# EAGLE board node6.7-frontend (EAGLE 5.10)
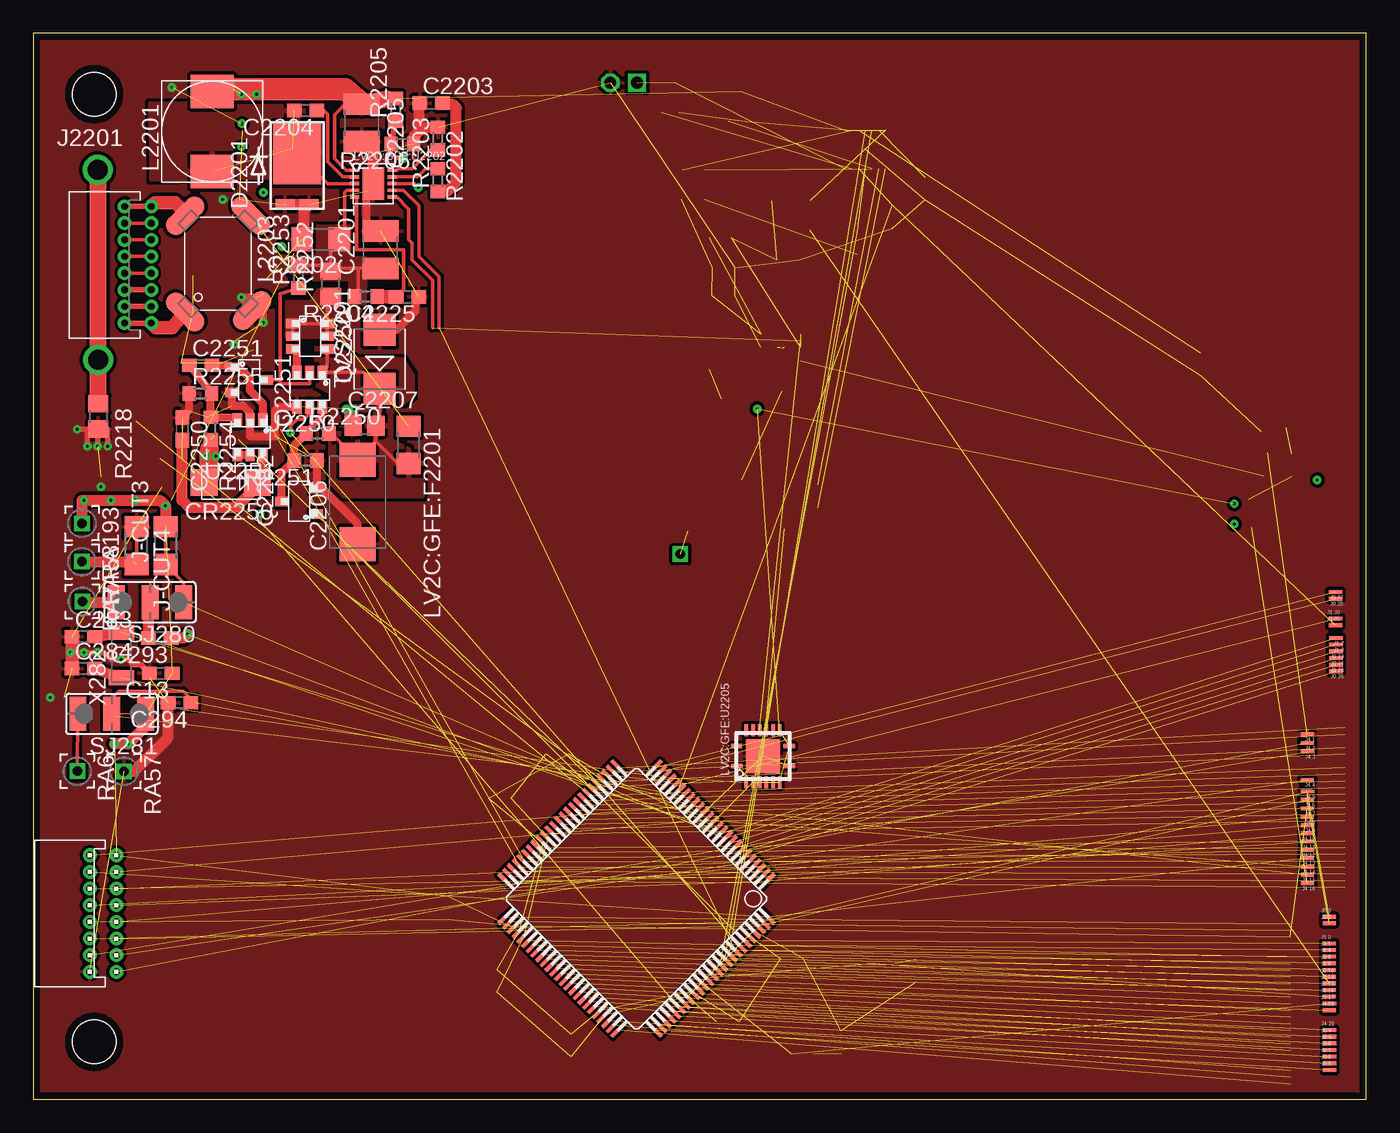
[diagram p2: board, top side]
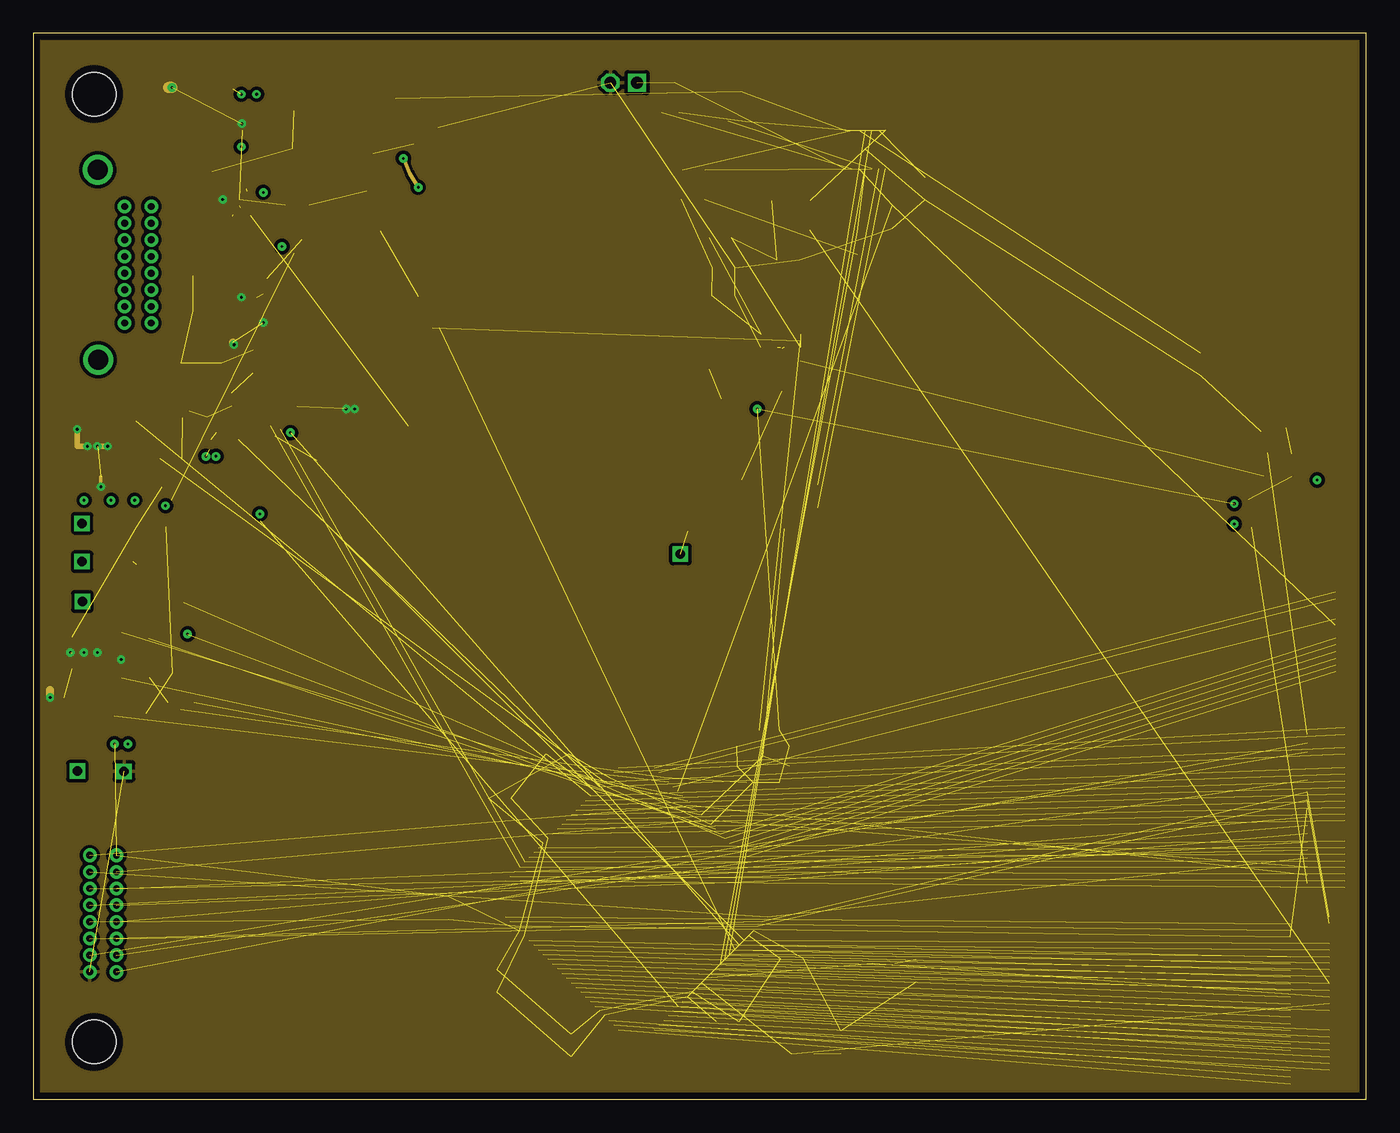
[diagram p3: board, inner layer Route2]
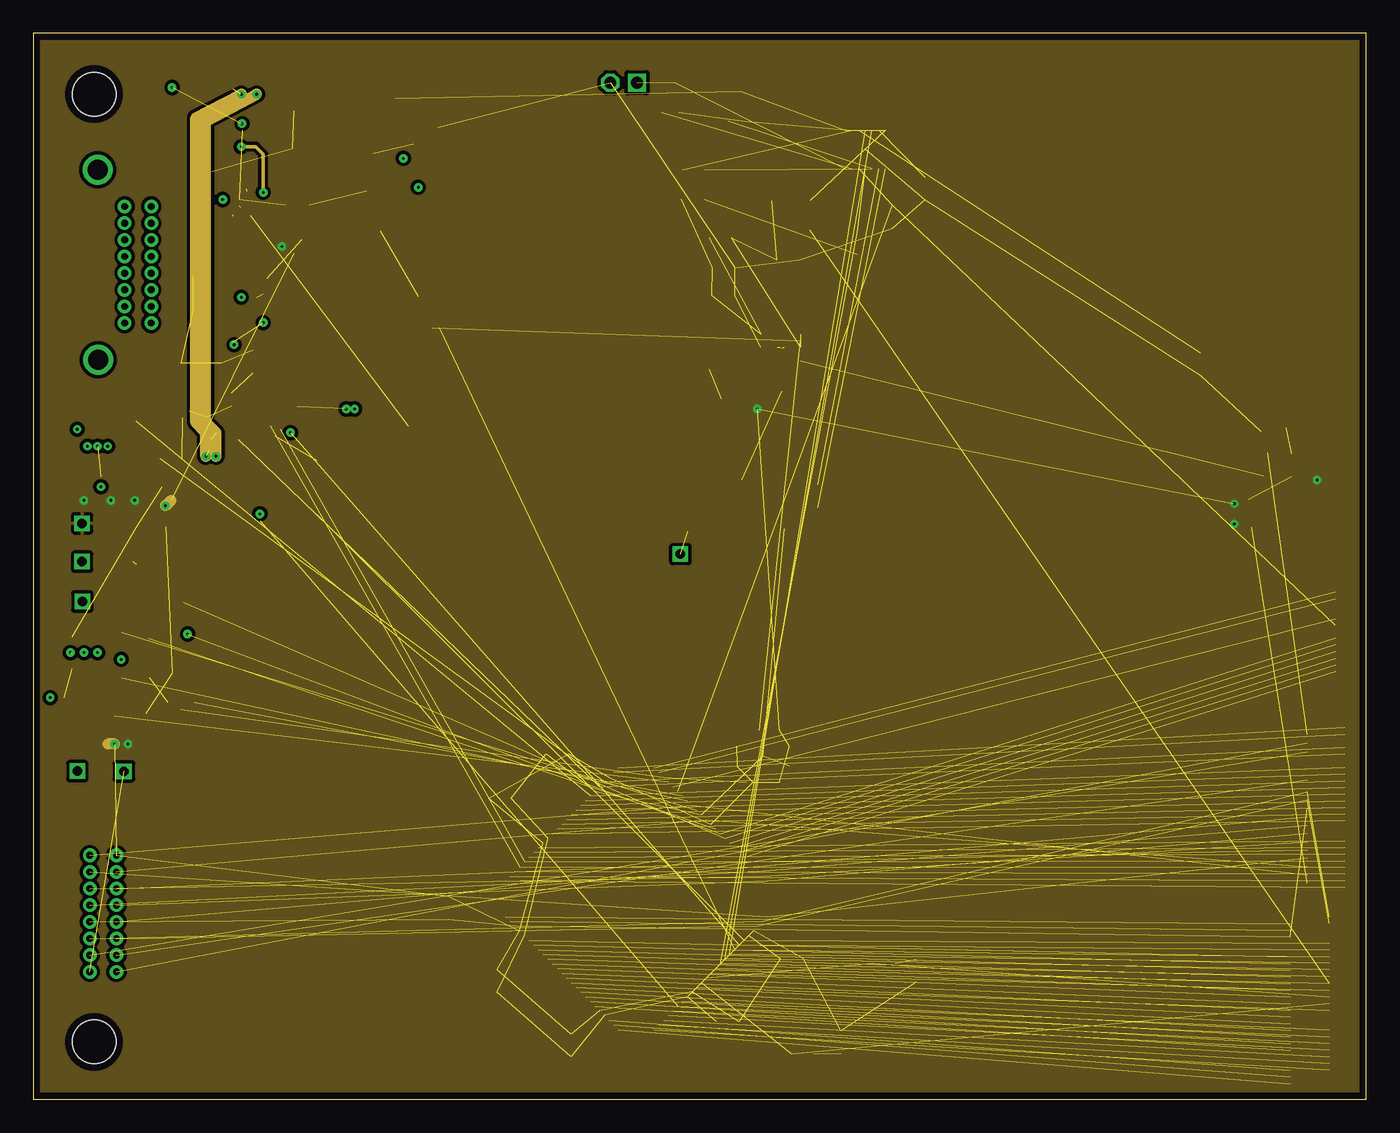
[diagram p4: board, inner layer Route15]
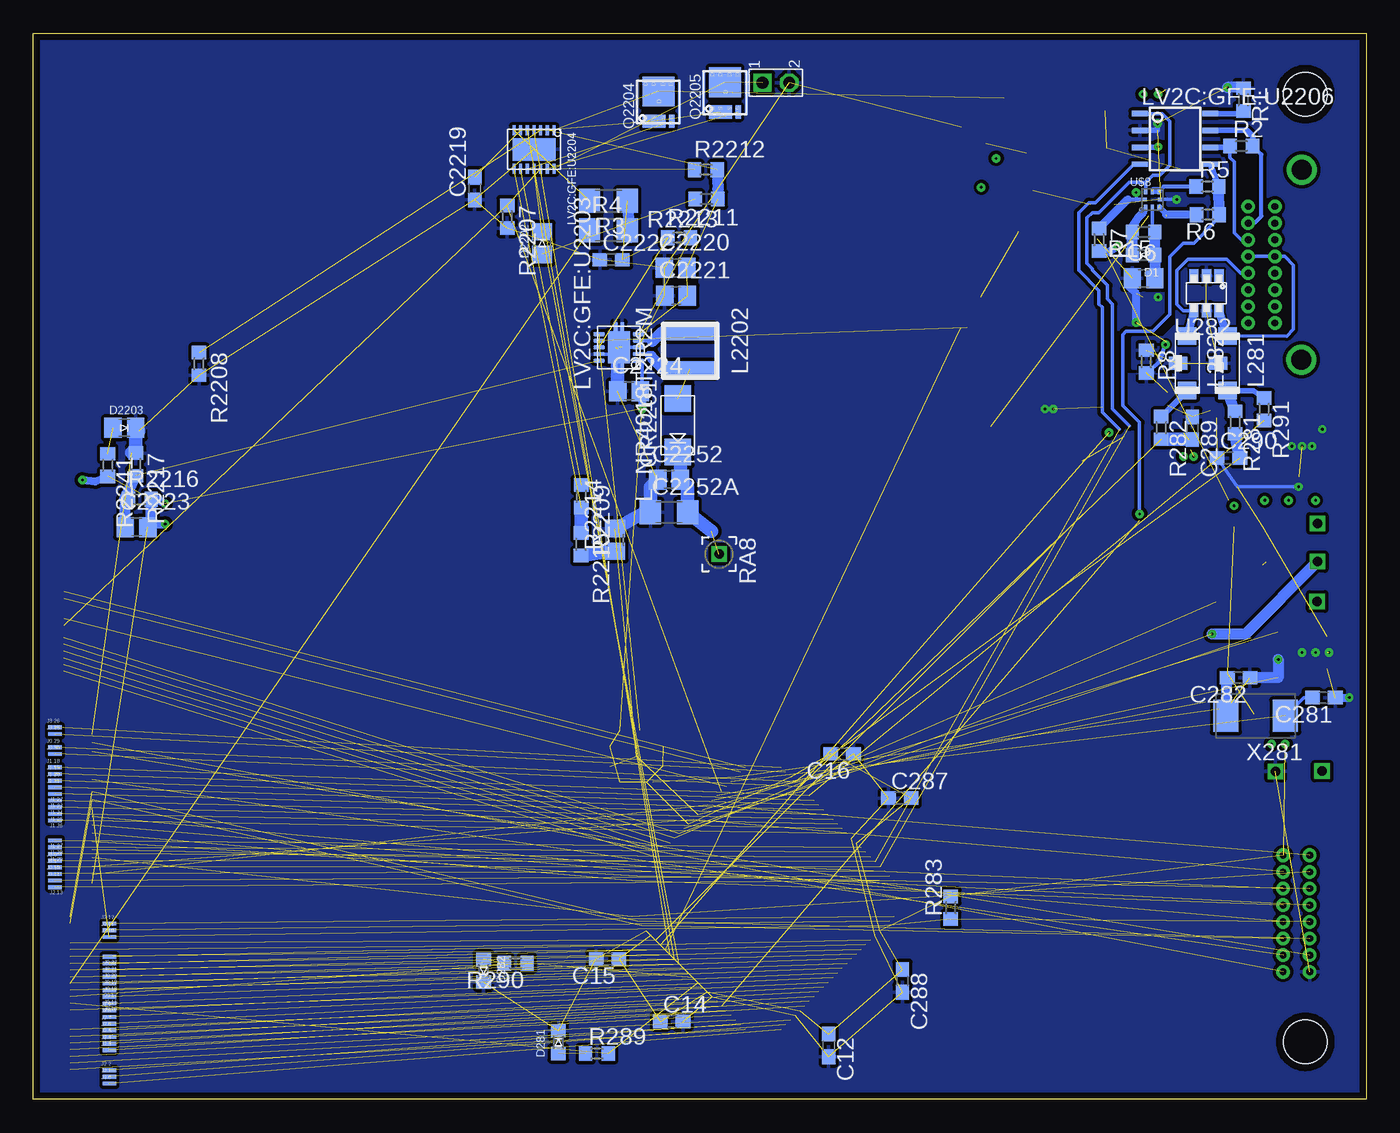
[diagram p5: board, bottom side, seen from below]

Size 100.08 x 80.01 mm. Coordinates in mm from the lower left corner, seen from the top.
Outline: 0,0 100.08,0 100.08,80.01 0,80 0,0
Copper layers (1+2*15+16): Top 0.0432mm / dielectric 0.3048mm / Route2 0.0356mm / dielectric 0.7112mm / Route15 0.0356mm / dielectric 0.3023mm / Bottom 0.0432mm
Design rules "sunstone_4lr_rules_v1.3_modifid *": minimum track width 6mil, minimum drill 8mil, track to track 6mil, track to pad 6mil, pad to pad 6mil, via to via 6mil, smd to smd 6mil, copper to edge 20mil, drill to drill 16mil, minimum pad ring 0.2118mm, minimum via ring 0.2118mm, stop-mask expansion 3mil, vias tented up to drill 0mil, thermal gap 10mil

## Footprints (pad centres in the part's own frame; a part is rotated, then mirrored left to right if it is on the bottom)
2MM-1X2-HEADER = drill 0.889 pad 1.372 square: 1 0,-1 | drill 0.889 pad 1.372 octagon: 2 0,1
C0805 = smd 1.3 x 1.5: 1 -0.85,0; 2 0.85,0
C0603 = smd 1.1 x 1: 1 -0.85,0; 2 0.85,0
C1210 = smd 1.6 x 2.7: 1 -1.4,0; 2 1.4,0
C1206 = smd 1.6 x 1.8: 1 -1.4,0; 2 1.4,0
D/7343-31R = smd 2.55 x 2.7: + 3.175,0; - -3.175,0
NMINIP2-J1 = smd 2 x 2: A 2,0; C -2,0
0603-DIODE = smd 1 x 1.1: A -0.85,0; K 0.85,0
D_POWERDI5 = smd 0.8 x 1.4: ANODE1 -3.47,-0.8; ANODE2 -3.47,1 | smd 4.7 x 3.6: CATHODE 0.4,0.1
0805-DIODE = smd 1.3 x 1.5: 1(ANODE) -0.85,0; 2(CATHODE) 0.85,0
ITTY-BITTY-PAD = smd 0.28 x 1: P$1 0,0
ROCKETBUS-PKG = drill 0.508 pad 1.016 round: AUX_1@1 0,-1.875; AUX_1@2 2,-1.875; AUX_2@1 0,-3.125; AUX_2@2 2,-3.125; B+@1 0,4.375; B+@2 2,4.375; B-@1 0,-4.375; B-@2 2,-4.375; CAN_H@1 0,3.125; CAN_H@2 2,3.125; CAN_L@1 0,1.875; CAN_L@2 2,1.875; USB_H@1 0,0.625; USB_H@2 2,0.625; USB_L@1 0,-0.625; USB_L@2 2,-0.625 | drill 1.511 round: CHASSIS@1 -2.032,7.136; CHASSIS@2 -1.982,-7.136
JST-16PS-JED = drill 0.508 pad 1.016 round: 1 4.375,-2; 2 4.375,0; 3 3.125,-2; 4 3.125,0; 5 1.875,-2; 6 1.875,0; 7 0.625,-2; 8 0.625,0; 9 -0.625,-2; 10 -0.625,0; 11 -1.875,-2; 12 -1.875,0; 13 -3.125,-2; 14 -3.125,0; 15 -4.375,-2; 16 -4.375,0
ZJ1206B = smd 1.6 x 1.803: 1 -1.422,0; 2 1.422,0
STAND-OFF = hole 3.302: 0,0
EXC-CET = smd 1.3 x 1.4: 1 -2.05,0; 2 2.05,0 | smd 1 x 1.4: C 0,-0.7
L-DR74 = smd 2.5 x 3.25: 1 -3,0; 2 3,0
L_NR4018 = smd 1.2 x 3.7: 1 -1.4,0; 2 1.4,0
CMS1 = smd 3.5 x 1.5 rotated 45: 1 3.608,-2.462; 3 -3.608,2.462 | smd 3.5 x 1.5 rotated 315: 2 3.508,2.562; 4 -3.608,-2.462
1206 = smd 1.6 x 1.8: 1 -1.4,0; 2 1.4,0
LQFP100 = smd 0.28 x 1.5: #RESET 2,-7.9; #RSTOUT 0.5,-7.9; #TRST -4.5,-7.9; P0[15]/TXD1/SCK0/SCK 0.5,7.9; P0[16]/RXD1/SSEL0/SSEL 0,7.9; P0[17]/CTS1/MISO0/MISO 1,7.9; P0[18]/DCD1/MOSI0/MOSI 1.5,7.9; P0[19]/DSR1/MCICLK/SDA1 2,7.9; P0[20]/DTR1/MCICMD/SCL1 2.5,7.9; P0[21]/RI1/MCIPWR/RD1 3,7.9; P0[22]/RTS1/MCIDAT0/TD1 3.5,7.9; P0[23]/AD0[0]/I2SRX_CLK/CAP3[0] -2,-7.9; P0[24]/AD0[1]/I2SRX_WS/CAP3[1] -2.5,-7.9; P0[25]/AD0[2]/I2SRX_SDA/TXD3 -3,-7.9; P0[26]/AD0[3]/AOUT/RXD3 -3.5,-7.9; P0[27]/SDA0 6,-7.9; P0[28]/SCL0 5.5,-7.9; P1[30]/VBUS/AD0[4] 4,-7.9; P1[31]/SCK1/AD0[5] 3.5,-7.9; P2[0]/PWM1[1]/TXD1/TRACECLK -6,7.9; P2[1]/PWM1[2]/RXD1/PIPESTAT0 -5.5,7.9; P2[2]/PWM1[3]/CTS1/PIPESTAT1 -5,7.9; P2[3]/PWM1[4]/DCD1/PIPESTAT2 -3.5,7.9; P2[4]/PWM1[5]/DSR1/TRACESYNC -3,7.9; P2[5]/PWM1[6]/DTR1/TRACEPKT0 -2.5,7.9; P2[6]/PCAP1[0]/RI1/TRACEPKT1 -2,7.9; P2[7]/RD2/RTS1/TRACEPKT2 -1.5,7.9; P2[8]/TD2/TXD2/TRACEPKT3 -1,7.9; P2[9]/USB_CONNECT/RXD2/EXTIN0 -0.5,7.9; P2[10]/#EINT0 5,7.9; P2[11]/#EINT1/MCIDAT1/I2STX_CLK 5.5,7.9; P2[12]/#EINT2/MCIDAT2/I2STX_WS 6,7.9; RTCX1 1.5,-7.9; RTCX2 2.5,-7.9; TCK -4,-7.9; TDI -5.5,-7.9; TDO -6,-7.9; TMS -5,-7.9; VBAT 3,-7.9; VDD(3V3)@1 4.5,7.9; VDD(3V3)@2 -4,7.9; VDD(DCDC)(3V3) 0,-7.9; VDDA -1.5,-7.9; VREF -0.5,-7.9; VSS 1,-7.9; VSS@3 4,7.9; VSS@4 -4.5,7.9; VSSA -1,-7.9; XTAL1 4.5,-7.9; XTAL2 5,-7.9 | smd 1.5 x 0.28: P0[0]/RD1/TXD3/SDA1 7.9,4; P0[1]/TD1/RXD3/SCL1 7.9,4.5; P0[2]/TXD0 -7.9,-5; P0[3]/RXD0 -7.9,-5.5; P0[4]/I2SRX_CLK/RD2/CAP2[0] -7.9,3.5; P0[5]/I2SRX_WS/TD2/CAP2[1] -7.9,4; P0[6]/I2SRX_SDA/SSEL1/MAT2[0] -7.9,4.5; P0[7]/I2STX_CLK/SCK1/MAT2[1] -7.9,5; P0[8]/I2STX_WS/MISO1/MAT2[2] -7.9,5.5; P0[9]/I2STX_SDA/MOSI1/MAT2[3] -7.9,6; P0[10]/TXD2/SDA2/MAT3[0] 7.9,5; P0[11]/RXD2/SCL2/MAT3[1] 7.9,5.5; P0[29]/USB_D+ 7.9,-4.5; P0[30]/USB_D- 7.9,-4; P1[0]/ENET_TXD0 -7.9,-3.5; P1[1]/ENET_TXD1 -7.9,-3; P1[4]/ENET_TX_EN -7.9,-2.5; P1[8]/ENET_CRS -7.9,-2; P1[9]/ENET_RXD0 -7.9,-1.5; P1[10]/ENET_RXD1 -7.9,-1; P1[14]/ENET_RX_ER -7.9,-0.5; P1[15]/ENET_REF_CLK -7.9,0; P1[16]/ENET_MDC -7.9,0.5; P1[17]/ENET_MDIO -7.9,1; P1[18]/USB_UP_LED/PWM1[1]/CAP1[0] 7.9,-3; P1[19]/CAP1[1] 7.9,-2.5; P1[20]/PWM1[2]/SCK0 7.9,-2; P1[21]/PWM1[3]/SSEL0 7.9,-1.5; P1[22]MAT1[0] 7.9,-1; P1[23]/PWM1[4]/MISO0 7.9,-0.5; P1[24]/PWM1[5]/MOSI0 7.9,0; P1[25]/MAT1[1] 7.9,0.5; P1[26]/PWM1[6]/CAP0[0] 7.9,1; P1[27]/CAP0[1] 7.9,2.5; P1[28]/PCAP1[0]/MAT0[0] 7.9,3; P1[29]/PCAP1[1]/MAT0[1] 7.9,3.5; P2[13]/#EINT3/MCIDAT3/I2STX_SDA 7.9,6; P3[25]/MAT0[0]/PWM1[2] 7.9,-5.5; P3[26]/MAT0[1]/PWM1[3] 7.9,-6; P4[28]/MAT2[0]/TXD3 -7.9,3; P4[29]/MAT2[1]/RXD3 -7.9,1.5; RTCK -7.9,-6; VDD(3V3) 7.9,-5; VDD(3V3)@3 -7.9,-4; VDD(DCDC)(3V3)@1 7.9,2; VDD(DCDC)(3V3)@2 -7.9,2; VSS@1 7.9,-3.5; VSS@2 7.9,1.5; VSS@5 -7.9,-4.5; VSS@6 -7.9,2.5
DFN-10 = smd 0.25 x 0.675: BD -1,-1.413; BOOST -0.5,-1.413; FB 0,1.413; PG 0.5,1.413; RT -1,1.413; RUN/SS 1,-1.413; SW 0,-1.413; SYNC 1,1.413; VC -0.5,1.413; VIN 0.5,-1.413 | smd 2.38 x 1.65: GND 0,0
SON-10 = smd 0.28 x 0.85: EN 1,1.475; FB -1,1.475; GND -0.5,1.475; L1 0.5,-1.475; L2 -0.5,-1.475; PGND 0,-1.475; PS/SYNC 0.5,1.475; VIN 1,-1.475; VINA 0,1.475; VOUT -1,-1.475 | smd 2.4 x 1.65: PGND@1 0,0 | smd 3.8 x 0.28: PGND@2 0,0.25; PGND@3 0,-0.25
DFN-14 = smd 0.25 x 0.7: 1 -1.5,-1.45; 2 -1,-1.45; 3 -0.5,-1.45; 4 0,-1.45; 5 0.5,-1.45; 6 1,-1.45; 7 1.5,-1.45; 8 1.5,1.45; 9 1,1.45; 10 0.5,1.45; 11 0,1.45; 12 -0.5,1.45; 13 -1,1.45; 14 -1.5,1.45 | smd 3.3 x 1.7: PGND 0,0
QFN-16 = smd 0.85 x 0.28: 1 -1.97,-0.75; 8 1.97,-0.74; 9 1.97,0.75; 16 -1.98,0.75 | smd 0.28 x 0.85: 2 -1.25,-1.95; 3 -0.75,-1.95; 4 -0.25,-1.95; 5 0.25,-1.95; 6 0.75,-1.95; 7 1.25,-1.95; 10 1.25,1.95; 11 0.75,1.95; 12 0.25,1.95; 13 -0.25,1.95; 14 -0.75,1.95; 15 -1.25,1.95 | smd 2.55 x 2.55: PGND 0,0
DR-PDSO-G8 = smd 0.4 x 1.2: 1 -1.905,-2.65; 2 -0.635,-2.65; 3 0.635,-2.65; 4 1.905,-2.65; 5 1.905,2.65; 6 0.635,2.65; 7 -0.635,2.65; 8 -1.905,2.65
1212-8_POWERPAK = smd 0.99 x 1.725: 1-2-3 -1.45,0.33 | smd 0.99 x 0.405: 4 -1.45,-0.99 | smd 2.24 x 2.39: 5-6-7-8 0.797,0
SOT23-6 = smd 0.7 x 1: 1 -0.95,-1.3; 2 0,-1.3; 3 0.95,-1.3; 4 0.95,1.3; 5 0,1.3; 6 -0.95,1.3
SOT23-3 = smd 0.7 x 1: 1 -0.95,-1.3; 2 0.95,-1.3; 3 0,1.3
R0603 = smd 1 x 1.1: 1 -0.85,0; 2 0.85,0
R1206 = smd 1.6 x 1.803: 1 -1.422,0; 2 1.422,0
R0805 = smd 1.3 x 1.5: 1 -0.85,0; 2 0.85,0
R0805' = smd 1.3 x 1.5: 1 -0.95,0; 2 0.95,0
PAD_SQUARE_APC-FREE_0.1/028 = drill 0.711 pad 1.168 square: PAD 0,0
SJ_2W = smd 1.27 x 2.54: 1 -2.54,0; 2 0,0; 3 2.54,0
SMB = smd 2.4 x 2.4: A 2.2,0; C -2.2,0
MICROPAK-8 = smd 0.25 x 0.4: 1 -0.5,-0.61; 2 0,-0.61; 3 0.5,-0.61; 5 0.5,0.61; 6 0,0.61; 7 -0.5,0.61 | smd 0.4 x 0.25: 4 0.6,0; 8 -0.6,0
CS10 = smd 1.905 x 2.413: P$1 -2.235,0; P$2 2.235,0
CM415 = smd 1.118 x 1.905: P$1 -1.702,0; P$2 1.702,0

## Placement (x,y rotation side)
B1  BATTERY_SINGLE_CELL_2MM  [2MM-1X2-HEADER]  44.32,76.3 270 bottom
C6  76nF  [C0805]  16.71,61.62 0 bottom
C12  0.1  [C0603]  40.36,4.05 270 bottom
C13  0.1  [C0603]  9.58,31.98 180 top
C14  0.1  [C0603]  52.15,5.84 0 bottom
C15  0.1  [C0603]  56.96,10.54 180 bottom
C16  0.1  [C0603]  39.34,25.93 180 bottom
C281  39 pF  [C0603]  3.17,30.15 180 bottom
C282  33 pF  [C0603]  9.58,31.65 180 bottom
C283  22 pF  [C0603]  3.76,34.72 0 top
C284  22 pF  [C0603]  3.76,32.33 0 top
C287  0.1  [C0603]  35.03,22.61 0 bottom
C288  0.1  [C0603]  34.82,8.89 270 bottom
C289  18pF  [C0603]  13.06,50.37 270 bottom
C290  18pF  [C0603]  10.34,48.13 0 bottom
C293  0.1  [C0603]  9.5,34.62 180 top
C294  0.1  [C0603]  10.97,29.77 180 top
C2201  10uF  [C1210]  26.06,63.77 90 top
C2202  1uF  [C1206]  21.59,64.55 180 top
C2203  680pF  [C0603]  29.87,74.77 0 top
C2204  0.22uF  [C0603]  20.44,74.22 180 top
C2205  22uF  [C1210]  24.67,73.28 270 top
C2206  22  [D/7343-31R]  24.35,44.83 90 top
C2207  0.33  [C0805]  24.87,50.57 0 top
C2219  depends on bat  [C0603]  66.93,68.35 90 bottom
C2220  4.7uF  [C0805]  51.84,62.41 0 bottom
C2221  4.7uF  [C0805]  51.82,60.33 0 bottom
C2222  0.1uF  [C0603]  56.69,63.02 0 bottom
C2223  2pF  [C0805]  92.33,42.95 0 bottom
C2224  22uF  [C0805]  55.35,53.16 0 bottom
C2225  0.1uF  [C0603]  28.09,60.23 180 top
C2250  2.7  [C0603]  11.2,50.32 270 top
C2251  0.015  [C0603]  12.57,55.09 0 top
C2252  TBD  [C0805]  52.35,46.51 0 bottom
C2252A  TBD  [C1206]  52.35,44.07 0 bottom
CR2201  MA2Q705  [NMINIP2-J1]  51.69,50.6 90 bottom
CR2250  MA2Q705  [NMINIP2-J1]  14.83,46.3 180 top
D1  CDSU101A  [0603-DIODE]  16.71,63.37 180 bottom
D281  LED-RED-0603  [0603-DIODE]  60.66,4.29 90 bottom
D282  LED-GRN-  [0603-DIODE]  66.27,9.65 270 bottom
D2201  D_PDS340  [D_POWERDI5]  19.91,70.63 90 top
D2202  LED-RED-0805  [0805-DIODE]  61.87,64.26 90 bottom
D2203  LED-ORG-0805  [0805-DIODE]  93.24,50.39 0 bottom
J0.0  CON_ITTY-BITTY-PAD  [ITTY-BITTY-PAD]  98.45,17.91 270 bottom
J0.1  CON_ITTY-BITTY-PAD  [ITTY-BITTY-PAD]  98.45,17.41 270 bottom
J0.2  CON_ITTY-BITTY-PAD  [ITTY-BITTY-PAD]  97.31,13.21 270 top
J0.3  CON_ITTY-BITTY-PAD  [ITTY-BITTY-PAD]  97.31,13.7 270 top
J0.4  CON_ITTY-BITTY-PAD  [ITTY-BITTY-PAD]  97.32,4.7 270 top
J0.5  CON_ITTY-BITTY-PAD  [ITTY-BITTY-PAD]  97.32,4.2 270 top
J0.6  CON_ITTY-BITTY-PAD  [ITTY-BITTY-PAD]  97.32,3.71 270 top
J0.7  CON_ITTY-BITTY-PAD  [ITTY-BITTY-PAD]  97.32,3.21 270 top
J0.8  CON_ITTY-BITTY-PAD  [ITTY-BITTY-PAD]  97.32,2.71 270 top
J0.9  CON_ITTY-BITTY-PAD  [ITTY-BITTY-PAD]  97.32,2.21 270 top
J0.10  CON_ITTY-BITTY-PAD  [ITTY-BITTY-PAD]  98.45,16.92 270 bottom
J0.11  CON_ITTY-BITTY-PAD  [ITTY-BITTY-PAD]  98.45,16.42 270 bottom
J0.15  CON_ITTY-BITTY-PAD  [ITTY-BITTY-PAD]  94.36,7.7 90 bottom
J0.16  CON_ITTY-BITTY-PAD  [ITTY-BITTY-PAD]  94.36,7.19 90 bottom
J0.17  CON_ITTY-BITTY-PAD  [ITTY-BITTY-PAD]  94.36,8.19 90 bottom
J0.18  CON_ITTY-BITTY-PAD  [ITTY-BITTY-PAD]  94.36,8.69 90 bottom
J0.19  CON_ITTY-BITTY-PAD  [ITTY-BITTY-PAD]  94.36,9.19 90 bottom
J0.20  CON_ITTY-BITTY-PAD  [ITTY-BITTY-PAD]  94.36,9.69 90 bottom
J0.21  CON_ITTY-BITTY-PAD  [ITTY-BITTY-PAD]  94.36,10.19 90 bottom
J0.22  CON_ITTY-BITTY-PAD  [ITTY-BITTY-PAD]  94.36,10.69 90 bottom
J0.23  CON_ITTY-BITTY-PAD  [ITTY-BITTY-PAD]  97.8,33.63 90 top
J0.24  CON_ITTY-BITTY-PAD  [ITTY-BITTY-PAD]  97.8,33.12 90 top
J0.25  CON_ITTY-BITTY-PAD  [ITTY-BITTY-PAD]  97.8,32.63 90 top
J0.26  CON_ITTY-BITTY-PAD  [ITTY-BITTY-PAD]  97.8,32.13 90 top
J0.27  CON_ITTY-BITTY-PAD  [ITTY-BITTY-PAD]  97.76,38.09 90 top
J0.28  CON_ITTY-BITTY-PAD  [ITTY-BITTY-PAD]  97.76,37.58 90 top
J0.29  CON_ITTY-BITTY-PAD  [ITTY-BITTY-PAD]  98.45,26.43 270 bottom
J0.30  CON_ITTY-BITTY-PAD  [ITTY-BITTY-PAD]  98.45,25.92 270 bottom
J1.0  CON_ITTY-BITTY-PAD  [ITTY-BITTY-PAD]  97.31,11.7 270 top
J1.1  CON_ITTY-BITTY-PAD  [ITTY-BITTY-PAD]  97.3,11.21 270 top
J1.2  CON_ITTY-BITTY-PAD  [ITTY-BITTY-PAD]  97.8,34.63 90 top
J1.3  CON_ITTY-BITTY-PAD  [ITTY-BITTY-PAD]  97.8,34.14 90 top
J1.4  CON_ITTY-BITTY-PAD  [ITTY-BITTY-PAD]  97.3,10.71 270 top
J1.8  CON_ITTY-BITTY-PAD  [ITTY-BITTY-PAD]  97.3,10.21 270 top
J1.9  CON_ITTY-BITTY-PAD  [ITTY-BITTY-PAD]  97.3,9.71 270 top
J1.10  CON_ITTY-BITTY-PAD  [ITTY-BITTY-PAD]  97.3,9.2 270 top
J1.14  CON_ITTY-BITTY-PAD  [ITTY-BITTY-PAD]  97.31,8.71 270 top
J1.15  CON_ITTY-BITTY-PAD  [ITTY-BITTY-PAD]  97.31,8.2 270 top
J1.16  CON_ITTY-BITTY-PAD  [ITTY-BITTY-PAD]  97.31,7.71 270 top
J1.17  CON_ITTY-BITTY-PAD  [ITTY-BITTY-PAD]  97.32,7.2 270 top
J1.18  CON_ITTY-BITTY-PAD  [ITTY-BITTY-PAD]  98.45,24.92 270 bottom
J1.19  CON_ITTY-BITTY-PAD  [ITTY-BITTY-PAD]  98.45,24.42 270 bottom
J1.20  CON_ITTY-BITTY-PAD  [ITTY-BITTY-PAD]  98.45,23.91 270 bottom
J1.21  CON_ITTY-BITTY-PAD  [ITTY-BITTY-PAD]  98.45,23.42 270 bottom
J1.22  CON_ITTY-BITTY-PAD  [ITTY-BITTY-PAD]  98.45,22.92 90 bottom
J1.23  CON_ITTY-BITTY-PAD  [ITTY-BITTY-PAD]  98.45,22.43 90 bottom
J1.24  CON_ITTY-BITTY-PAD  [ITTY-BITTY-PAD]  98.45,21.92 90 bottom
J1.25  CON_ITTY-BITTY-PAD  [ITTY-BITTY-PAD]  98.45,21.42 90 bottom
J1.26  CON_ITTY-BITTY-PAD  [ITTY-BITTY-PAD]  98.45,20.93 90 bottom
J1.27  CON_ITTY-BITTY-PAD  [ITTY-BITTY-PAD]  98.45,19.42 90 bottom
J1.28  CON_ITTY-BITTY-PAD  [ITTY-BITTY-PAD]  98.45,18.92 90 bottom
J1.29  CON_ITTY-BITTY-PAD  [ITTY-BITTY-PAD]  98.45,18.41 90 bottom
J1.30  CON_ITTY-BITTY-PAD  [ITTY-BITTY-PAD]  97.76,36.08 270 top
J1.31  CON_ITTY-BITTY-PAD  [ITTY-BITTY-PAD]  97.76,35.59 270 top
J2.0  CON_ITTY-BITTY-PAD  [ITTY-BITTY-PAD]  94.36,1.18 270 bottom
J2.1  CON_ITTY-BITTY-PAD  [ITTY-BITTY-PAD]  94.36,1.69 270 bottom
J2.2  CON_ITTY-BITTY-PAD  [ITTY-BITTY-PAD]  94.36,2.18 270 bottom
J2.3  CON_ITTY-BITTY-PAD  [ITTY-BITTY-PAD]  94.36,3.68 270 bottom
J2.4  CON_ITTY-BITTY-PAD  [ITTY-BITTY-PAD]  94.36,4.18 270 bottom
J2.5  CON_ITTY-BITTY-PAD  [ITTY-BITTY-PAD]  94.36,4.69 270 bottom
J2.6  CON_ITTY-BITTY-PAD  [ITTY-BITTY-PAD]  94.36,5.18 270 bottom
J2.7  CON_ITTY-BITTY-PAD  [ITTY-BITTY-PAD]  94.36,5.68 270 bottom
J2.8  CON_ITTY-BITTY-PAD  [ITTY-BITTY-PAD]  94.36,6.18 270 bottom
J2.9  CON_ITTY-BITTY-PAD  [ITTY-BITTY-PAD]  94.36,6.68 270 bottom
J2.10  CON_ITTY-BITTY-PAD  [ITTY-BITTY-PAD]  94.36,12.19 270 bottom
J2.11  CON_ITTY-BITTY-PAD  [ITTY-BITTY-PAD]  94.36,12.69 270 bottom
J2.12  CON_ITTY-BITTY-PAD  [ITTY-BITTY-PAD]  94.36,13.2 270 bottom
J2.13  CON_ITTY-BITTY-PAD  [ITTY-BITTY-PAD]  98.45,15.91 90 bottom
J3.25  CON_ITTY-BITTY-PAD  [ITTY-BITTY-PAD]  98.45,27.42 270 bottom
J3.26  CON_ITTY-BITTY-PAD  [ITTY-BITTY-PAD]  98.45,27.93 270 bottom
J4.1  CON_ITTY-BITTY-PAD  [ITTY-BITTY-PAD]  95.66,27.41 90 top
J4.2  CON_ITTY-BITTY-PAD  [ITTY-BITTY-PAD]  95.66,26.75 90 top
J4.3  CON_ITTY-BITTY-PAD  [ITTY-BITTY-PAD]  95.67,26.1 90 top
J4.4  CON_ITTY-BITTY-PAD  [ITTY-BITTY-PAD]  95.66,23.98 90 top
J4.5  CON_ITTY-BITTY-PAD  [ITTY-BITTY-PAD]  95.67,23.1 90 top
J4.6  CON_ITTY-BITTY-PAD  [ITTY-BITTY-PAD]  95.66,22.48 90 top
J4.7  CON_ITTY-BITTY-PAD  [ITTY-BITTY-PAD]  95.66,21.83 90 top
J4.8  CON_ITTY-BITTY-PAD  [ITTY-BITTY-PAD]  95.66,21.21 90 top
J4.9  CON_ITTY-BITTY-PAD  [ITTY-BITTY-PAD]  95.67,20.57 90 top
J4.10  CON_ITTY-BITTY-PAD  [ITTY-BITTY-PAD]  95.66,19.96 90 top
J4.11  CON_ITTY-BITTY-PAD  [ITTY-BITTY-PAD]  95.67,19.34 90 top
J4.12  CON_ITTY-BITTY-PAD  [ITTY-BITTY-PAD]  95.67,18.73 90 top
J4.13  CON_ITTY-BITTY-PAD  [ITTY-BITTY-PAD]  95.66,18.14 90 top
J4.14  CON_ITTY-BITTY-PAD  [ITTY-BITTY-PAD]  95.67,17.46 90 top
J4.15  CON_ITTY-BITTY-PAD  [ITTY-BITTY-PAD]  95.66,16.85 90 top
J4.16  CON_ITTY-BITTY-PAD  [ITTY-BITTY-PAD]  95.66,16.22 90 top
J4.28  CON_ITTY-BITTY-PAD  [ITTY-BITTY-PAD]  97.32,5.21 270 top
J4.29  CON_ITTY-BITTY-PAD  [ITTY-BITTY-PAD]  97.31,6.69 270 top
J2201  ROCKETBUS  [ROCKETBUS-PKG]  6.86,62.64 0 top
J2204  JST-16PS-JED  [JST-16PS-JED]  4.24,13.94 90 top
J-CUT3  J_CUT_1206  [ZJ1206B]  9.93,41.55 90 top
J-CUT4  J_CUT_1206  [ZJ1206B]  7.75,41.55 270 top
JP1  STAND-OFF  [STAND-OFF]  4.57,75.44 0 top
JP2  STAND-OFF  [STAND-OFF]  4.57,4.32 0 top
L281  EXC-CET471U  [EXC-CET]  10.41,55.24 270 bottom
L282  FILTER_EMI-EXC-CET  [EXC-CET]  13.44,55.24 270 bottom
L2201  L_DR74-6R8-R  [L-DR74]  13.43,72.64 90 top
L2202  L_NR4018T2R2M  [L_NR4018]  50.75,56.18 270 bottom
L2203  CMS1  [CMS1]  13.87,62.71 270 top
LV2C:GFE:F2201  2.0A Fast  [1206]  28.17,49.12 270 top
LV2C:GFE:U2201  IC_LPC2368  [LQFP100]  45.29,15.06 135 top
LV2C:GFE:U2202  IC_LT3972  [DFN-10]  25.52,68.74 270 top
LV2C:GFE:U2203  IC_TPS63000  [SON-10]  56.11,56.44 90 bottom
LV2C:GFE:U2204  IC_LTC4085  [DFN-14]  62.48,71.29 180 bottom
LV2C:GFE:U2205  IC_SN74LV163A  [QFN-16]  54.79,25.76 0 top
LV2C:GFE:U2206  IC_SN65HVD235  [DR-PDSO-G8]  14.35,72.09 270 bottom
Q2204  P-MOS_SI7123DN  [1212-8_POWERPAK]  53.14,74.85 90 bottom
Q2205  P-MOS_SI7123DN  [1212-8_POWERPAK]  48.15,75.55 90 bottom
Q2250  ZXMP6A17E6TA  [SOT23-6]  20.78,57.28 270 top
Q2251  BSS123E6327  [SOT23-3]  16.21,54 270 top
Q2282  BSS123E6327  [SOT23-3]  19.96,44.88 90 top
R1  18k  [R0603]  9.22,75.03 270 bottom
R2  60  [R0603]  9.37,71.55 0 bottom
R3  100k  [R1206]  56.9,67.44 180 bottom
R4  100k  [R1206]  56.9,65.23 0 bottom
R5  0  [R0603]  11.91,68.5 0 bottom
R6  0  [R0603]  11.89,66.4 180 bottom
R7  0  [R0603]  20.07,64.52 270 bottom
R8  0  [R0603]  16.51,55.37 270 bottom
R15  10k  [R0603]  16.71,65.1 180 bottom
R281  33.2  [R0603]  9.86,50.8 270 bottom
R282  33.2  [R0603]  15.39,50.39 270 bottom
R283  10.0k  [R0603]  31.19,14.38 90 bottom
R289  649  [R0603]  57.76,3.43 0 bottom
R290  649  [R0603]  63.86,10.21 180 bottom
R291  1.5k  [R0603]  7.67,51.79 270 bottom
R2202  26.7k  [R0603]  30.37,72.11 270 top
R2203  15k  [R0603]  30.38,68.99 90 top
R2204  500k  [R0603]  24.97,60.25 180 top
R2205  532k  [R0603]  27.21,74.27 90 top
R2206  100k  [R0603]  27.71,71.71 180 top
R2207  100k  [R0603]  64.49,66.24 270 bottom
R2208  660  [R0603]  87.63,55.19 270 bottom
R2209  115k 1%  [R0603]  58.93,45.26 270 bottom
R2211  100  [R0603]  51.59,64.67 0 bottom
R2212  1k  [R0603]  49.58,69.77 0 bottom
R2213  510  [R0603]  49.53,67.56 180 bottom
R2214  Thermistor-100k @25C  [R0805]  56.39,41.99 90 bottom
R2215  15k 1%  [R0603]  58.95,41.66 270 bottom
R2216  1.0M  [R0603]  92.08,45.03 0 bottom
R2217  200k  [R0603]  92.38,47.65 270 bottom
R2218  100k  [R0805']  4.88,51.26 270 top
R2241  649  [R0603]  94.49,47.6 270 bottom
R2250  61.9k  [R0603]  21.34,49.97 0 top
R2251  10.0k  [R0603]  20.45,47.94 180 top
R2252  0.82  [R0805']  22.32,61.2 90 top
R2253  47k  [R0603]  19.89,61.74 90 top
R2254  33.0k  [R0603]  13.34,50.34 270 top
R2255  10.0k  [R0603]  12.55,52.98 0 top
RA6  t24  [PAD_SQUARE_APC-FREE_0.1/028]  3.3,24.64 270 top
RA7  t24  [PAD_SQUARE_APC-FREE_0.1/028]  3.68,37.36 270 top
RA8  t24  [PAD_SQUARE_APC-FREE_0.1/028]  48.59,40.92 270 bottom
RA57  t24  [PAD_SQUARE_APC-FREE_0.1/028]  6.81,24.61 270 top
RA58  t24  [PAD_SQUARE_APC-FREE_0.1/028]  3.66,40.36 270 top
RA193  3P3  [PAD_SQUARE_APC-FREE_0.1/028]  3.66,43.23 270 top
SJ280  [SJ_2W]  8.76,37.31 180 top
SJ281  [SJ_2W]  5.89,28.93 180 top
TVS2201  SMBJ18A  [SMB]  26,55.55 90 top
U282  SN65220DBVR  [SOT23-6]  11.99,60.5 180 bottom
U2250  MAX5902AAETT  [SOT23-6]  20.75,53.26 180 top
U2251  TLV3012AIDBVT  [SOT23-6]  16.28,49.68 180 top
U$8  IC_NC7NP14  [MICROPAK-8]  16.05,67.54 0 bottom
X281  12.0 MHz  [CS10]  8.31,28.78 180 bottom
X282  32.768 kHz  [CM415]  6.63,33.35 90 top

## Tracks (layer width: path | path; a pad name or v marks a point on that pad's centre or on a via)
3.3V_HAP_OUT  (via drill 0.2)  (31 unrouted)
  Top 0.813: J-CUT3.2 v9.93,44.55 9.53,44.96 v7.62,44.96 v5.84,44.96 v3.81,44.96 3.66,44.96 RA193.PAD | SJ281.1 8.43,27.99 v7.11,26.67 v6.1,26.67
  Route15 0.813: v9.93,44.55 10.34,44.96 | v6.1,26.67 5.59,26.67
  Bottom 0.254: LV2C:GFE:U2203.VOUT 54.42,55.44 54.36,55.37 54.36,53.3 C2224.2
  Bottom 0.61: R7.2 19.56,63.5 v18.67,64.01 | R2216.2 90.75,45.03 v90.17,44.7 | C2223.2 arc90 91.25,43.18 v90.17,43.18 | 54.36,53.3 v54.36,51.82 | R2241.2 95.39,46.37 v96.39,46.48
  Bottom 0.813: C2223.2 91.22,43.46 R2216.2
  pour Route15 (isolate 0.254, rank 4): 0,80.01 100.08,80.01 100.08,0 0,0
!RESET!  (2 unrouted)
!RSTOUT!  (2 unrouted)
!SPS_POWER_PRESENT!  (2 unrouted)
!TRST!  (2 unrouted)
A_3P3  (2 unrouted)
  Top 0.254: J-CUT3.1 11.3,38.76 SJ280.1
A_GND  (via drill 0.2)  (3 unrouted)
  Top 0.813: RA58.PAD 7.52,40.36 | C293.1 11.28,34.62 v11.58,34.92
  Bottom 0.813: v11.58,34.92 9.09,34.92 RA58.PAD
AUX_1.2
  Top 0.406: J2201.AUX_1@1 J2201.AUX_1@2
AUX_2.2
  Top 0.406: J2201.AUX_2@1 J2201.AUX_2@2
BATTERY_CHARGE  (2 unrouted)
BATTERY_CONNECT_CONTROL  (1 unrouted)
BIAS_VOLTS_FOR_NTC_THERMISTOR  (1 unrouted)
BIN  (1 unrouted)
CAN1_H
  Top 0.254: J2201.CAN_H@1 J2201.CAN_H@2
  Bottom 0.305: J2201.CAN_H@2 8.41,65.76 7.87,66.29 7.87,70.9 R2.2
  Bottom 0.406: R2.2 8.52,72.28 8.97,72.72 LV2C:GFE:U2206.7
CAN1_L
  Top 0.254: J2201.CAN_L@1 J2201.CAN_L@2
  Bottom 0.254: 10.32,71.45 R2.1 10.22,70.67 9.91,70.36 9.91,65.02 9.39,64.51 J2201.CAN_L@2
  Bottom 0.406: 10.32,71.45 LV2C:GFE:U2206.6
CHARGE_TIMER  (1 unrouted)
CHASSIS
  Top 1.27: J2201.CHASSIS@1 4.88,69.77 J2201.CHASSIS@2 R2218.1
CPU_VBAT  (1 unrouted)
  Top 0.254: C294.1 12.08,29.81 11.25,30.63 6.4,30.63 5.92,30.15 5.92,28.96 SJ281.2
CPU_VREF  (1 unrouted)
  Top 0.254: 8.65,37.2 SJ280.2
  Top 0.813: C293.2 8.65,37.2
CPU_XTAL1  (1 unrouted)
  Bottom 0.254: X281.P$1 4.7,30.15 C281.2
CPU_XTAL2  (2 unrouted)
  Bottom 0.813: 11.05,29.29 X281.P$2 C282.2
DEBUG.13  (1 unrouted)
DEBUG.14  (1 unrouted)
DEBUG.15  (1 unrouted)
DOMINANT_BIT_STUCK_WHEN_HIGH
  Bottom 0.254: U$8.2 16.05,65.17 R15.1
  Bottom 0.813: C6.2 D1.A R15.1
EXT_VBAT
  Top 0.254: RA6.PAD SJ281.3
EXT_VREF
  Top 0.254: RA7.PAD 3.73,37.31
  Top 0.813: 3.73,37.31 SJ280.3
FB  (1 unrouted)
  Bottom 0.406: 93.22,45.03 93.22,45.21
  Bottom 0.813: C2223.1 93.18,44.53 R2216.1 93.22,45.03 R2217.2
GND  (via drill 0.2)  (53 unrouted)
  Top 0.254: 25.02,65.2 C2201.2 | 25.52,71.03 C2205.2
  Top 0.406: 2.91,33.53 v3.81,33.53 v4.83,33.53 5.33,33.53 5.84,33.02 v6.6,33.02 7.11,33.02 7.52,32.61 8.09,32.61 C13.2 | R2218.2 5.59,50.31 v5.59,49.02 | v4.83,49.02 4.83,50.29 4.06,50.29 | 4.06,50.29 v4.06,49.02 | 4.06,50.29 v3.3,50.29
  Top 0.61: 16.76,60.2 v15.62,60.2 16.43,59.26 L2203.2 | v24.13,51.82 24.13,50.57 C2207.1 v23.5,51.82 | 25.02,65.2 25.02,68.2 25.52,68.7 LV2C:GFE:U2202.GND | Q2251.2 14.9,52.07 15.75,52.07 16.28,51.54 U2251.2 16.26,50.98 16.26,49.78 18.16,49.78 18.16,51.69 18.44,51.96 U2250.4 | v17.27,58.29 17.27,59.69 | C2206.- 24.35,43.22 21.73,45.83 Q2282.2 21.3,45.87 R2251.1 | TVS2201.A 27.27,57.75 28.7,59.18 28.7,59.99 C2225.1 | R2255.1 11.7,51.66 C2250.1
  Top 0.813: C294.2 10.12,27.14 7.59,24.61 RA57.PAD | LV2C:GFE:U2202.GND 25.52,71.03 | R2206.1 28.56,72.25 28.96,72.64 | 28.96,72.64 28.96,74.71 C2203.1 | 28.96,72.64 29.27,72.96 R2202.1 | D2201.ANODE2 D2201.ANODE1 20.32,66.77 20.32,65.53 20.31,65.02 C2202.2
  Top 1.016: C284.1 2.91,33.53 C283.1
  Route2 0.254: v5.08,45.97 5.08,46.74 | v14.22,67.54 14.12,67.54
  Route2 0.406: v3.3,50.29 3.3,49.02 v4.06,49.02 | v5.59,49.02 v4.83,49.02 | v15.67,73.23 15.75,73.23
  Route2 0.61: v15.07,56.64 14.99,56.81 | v1.27,30.15 1.27,30.73
  Route2 0.813: v10.41,75.95 10.16,75.95
  Bottom 0.254: C290.1 9.66,45.99 v5.08,45.97 | LV2C:GFE:U2203.PGND@1 LV2C:GFE:U2203.PGND | LV2C:GFE:U2203.GND 56.25,55.94 56.2,55.88 | 14.76,67.54 U$8.4 v14.22,67.54
  Bottom 0.305: R8.2 15.49,55.37 v15.07,56.64
  Bottom 0.406: LV2C:GFE:U2206.2 15.67,72.72 v15.67,73.23
  Bottom 0.61: C281.1 v1.27,30.15 | v17.27,58.29 17.27,60.45 17.82,61 C6.1
  Bottom 0.813: C282.1 6.6,31.65 v6.6,33.02 | R1.1 9.22,75.95 v10.41,75.95
  Bottom 1.016: C2224.1 56.2,55.88 56.2,56.35 LV2C:GFE:U2203.PGND@1 | 92.15,50.15 arc90 D2203.2(CATHODE) 92.39,48.83 92.7,48.53 R2217.1 | C2252.1 53.75,45.96 C2252A.1 53.88,44.2 R2214.2
  other vias: 2.79,33.53
  pour Bottom (isolate 0.254, rank 4): 100.08,0 0,0 0,80.01 100.08,80.01 100.08,71.63
  pour Top (isolate 0.254, rank 4): 0,0 0,80.01 100.08,80.01 100.08,0
  pour Route2 (isolate 0.254, rank 4): 0,80.01 100.08,80.01 100.08,0 0,0
IN+
  Top 0.61: C2251.1 R2255.2 13.34,52.92 R2254.1 15.12,51.19 U2251.3
IN_CURRENT_LIMIT_PROG  (1 unrouted)
INV-INV  (2 unrouted)
  Bottom 0.254: U$8.5 U$8.6 | 16,68.33 15.49,68.33 | 15.49,68.07 16,68.07
  Bottom 0.305: R5.1 15.2,68.5 U$8.5
INV_DATA
  Bottom 0.254: 17.27,66.21 16.76,66.55 16.76,66.72 U$8.1 | R15.2 17.56,65.5
  Bottom 0.406: 17.02,66.29 16.64,66.67
  Bottom 0.61: 17.56,65.5 17.02,66.29 16.76,66.55
  Bottom 0.813: D1.K R15.2
IO_3P3  (via drill 0.2)
  Route15 0.254: v17.27,68.07 17.27,70.92 16.7,71.5 v15.62,71.5
  Bottom 0.254: U$8.8 17.27,67.54 v17.27,68.07
  Bottom 0.305: 17.89,67.54 U$8.8
  Bottom 0.406: LV2C:GFE:U2206.3 15.62,71.45 v15.62,71.5
  Bottom 0.61: R7.1 17.89,67.54
IO_GND  (4 unrouted)
  pour Bottom (rank 3): 9.91,61.98 10.67,62.74 13.46,62.74 14.22,61.98 14.22,58.17 15.24,57.15 17.53,57.15 17.53,54.86 14.99,54.86 13.21,53.09 9.91,53.09
L_IN
  Bottom 0.254: LV2C:GFE:U2203.L1 53.89,56.94 53.85,56.9
  Bottom 0.406: 53.59,56.9 53.85,56.9
  Bottom 0.813: 53.59,56.9 52.91,57.58 L2202.1
L_OUT  (1 unrouted)
  Bottom 0.254: LV2C:GFE:U2203.L2 53.9,55.94 53.85,55.88 53.59,55.63
  Bottom 0.61: L2202.2 52.75,54.78 | 53.85,55.88 53.59,55.88
  Bottom 0.813: 52.75,54.78 53.59,55.63
LED200_A  (1 unrouted)
MAX_UVLO
  Top 0.406: U2250.6 21.7,50.93 21.34,50.93 20.49,50.08 R2250.1
  Top 0.61: R2250.1 19.6,49.08 R2251.2 18.66,47.01 Q2282.3
N$2
  Top 0.406: J2201.B+@1 J2201.B+@2
  Top 1.016: L2203.4 11.51,66.47 10.67,67.31 9.16,67.31 J2201.B+@2
N$3
  Top 0.254: LV2C:GFE:U2202.VC 28.85,69.24 29.45,69.84 R2203.2
N$4
  Top 0.254: LV2C:GFE:U2202.RT 27.32,69.74 27.43,69.85 28.45,69.85 29.86,71.26 R2202.2
N$5
  Top 0.813: R2203.1 31.05,68.14 31.75,68.83 31.75,74.42 31.5,74.68 30.82,74.68 C2203.2
N$6  (2 unrouted)
  Bottom 0.254: 14.99,66.55 15.49,67.06 | 14.99,66.29 15.49,66.8
  Bottom 0.305: 15.02,66.4 U$8.3
  Bottom 0.61: R6.2 15.02,66.4
N$7  (1 unrouted)
  Bottom 0.254: 50.33,67.36 R2213.2
N$10
  Bottom 1.016: R2214.1 57.25,41.06 R2215.2
N_DRAIN
  Top 0.254: R2253.1 18.54,60.45 18.54,54 | 18.54,54 18.54,53.72 20.75,53.72 U2250.2 | Q2251.3 18.54,54
N_GATE
  Top 0.61: C2251.2 14.76,55.09 Q2251.1 15.41,54.95 16.26,54.1 16.26,53.21 17.23,52.24 U2251.1
NTC_INPUT_FROM_BATTERY  (1 unrouted)
  Bottom 1.016: R2215.1 58.97,43.53 R2209.2
P_GATE
  Top 0.61: U2250.3 19.8,56.01 Q2250.3
PIC_LAMP  (1 unrouted)
PORT0.0/RD1/TXD3/SDA1  (2 unrouted)
  Bottom 0.254: 18.54,50.29 19.81,51.56 19.81,59.44 20.07,59.69 20.07,60.71 21.59,62.23 21.59,66.55 20.83,67.31 20.32,67.31 17.45,70.18 LV2C:GFE:U2206.4
PORT0.1/TD1/RXD3/SCL1  (2 unrouted)
  Bottom 0.254: LV2C:GFE:U2206.1 15.32,73.99 14.73,73.41 14.73,70.1 15.49,69.34 16,69.34 16.55,68.79 U$8.7 16.55,68.83 17.78,68.83 20.07,66.55 20.57,66.55 20.95,66.17 20.95,62.74 20.57,62.36 20.57,62.23 19.43,61.09 19.43,60.07 19.05,59.69 19.05,51.82 17.78,50.55
PORT0.2/TXD0  (3 unrouted)
PORT0.3/RXD0  (3 unrouted)
PORT0.4/I2SRX_CLK/RD2/CAP2.0  (via drill 0.2)  (2 unrouted)
  Top 0.254: v17.02,43.94 17.02,43.43
  Bottom 0.254: R6.1 11.43,66 11.43,65.79 12.95,64.26 13.72,64.26 14.73,63.25 14.73,58.93 16,57.66 18.03,57.66 18.29,57.4 18.29,52.07 17.02,50.8 v17.02,43.94
  Bottom 0.406: R5.2 LV2C:GFE:U2206.5
  Bottom 0.813: R6.1 R5.2
PORT0.5/I2SRX_WS/TD2/CAP2.1  (1 unrouted)
PORT0.6/I2SRX_SDA/SSEL1/MAT2.0  (1 unrouted)
PORT0.7/I2STX_CLK/SCK1/MAT2.1  (1 unrouted)
PORT0.8/I2STX_WS/MISO1/MAT2.2  (1 unrouted)
PORT0.9/I2STX_SDA/MOSI1/MAT2.3  (1 unrouted)
PORT0.10/TXD2/SDA2/MAT3.0  (1 unrouted)
PORT0.11/RXD2/SCL2/MAT3.1  (1 unrouted)
PORT0.15/TXD1/SCK0/SCK  (1 unrouted)
PORT0.16/RXD1/SSEL0/SSEL  (1 unrouted)
PORT0.17/CTS1/MISO0/MISO  (1 unrouted)
PORT0.18/DCD1/MOSI0/MOSI  (1 unrouted)
PORT0.19/DSR1/MCICLK/SDA1  (1 unrouted)
PORT0.20/DTR1/MCICMD/SCL1  (1 unrouted)
PORT0.21/RI1/MCIPWR/RD1  (1 unrouted)
PORT0.22/RTS1/MCIDAT0/TD1  (1 unrouted)
PORT0.23/AD0.0/I2SRX_CLK/CAP3.0  (1 unrouted)
PORT0.24/AD0.1/I2SRX_WS/CAP3.1  (1 unrouted)
PORT0.25/AD0.2/I2SRX_SDA/TXD3  (1 unrouted)
PORT0.26/AD0.3/AOUT/RXD3  (1 unrouted)
PORT0.27/SDA0  (1 unrouted)
PORT0.28/SCL0  (1 unrouted)
PORT0.29/USB_D+  (2 unrouted)
  Bottom 0.254: R281.2 10.2,50.29
  Bottom 0.813: C290.2 R281.2
PORT0.30/USB_D-  (2 unrouted)
  Bottom 0.61: C289.2 13.2,49.52 13.21,49.53
  Bottom 1.016: 13.21,49.53 15.38,49.53 R282.2
PORT1.0/GPIO_SPS_DISABLE  (2 unrouted)
PORT1.1/GPIO_SPS_V-IN_GOOD  (via drill 0.2)  (2 unrouted)
  Top 0.254: U2250.5 20.75,51.49 20.32,51.05 19.81,51.05 19.3,50.55 v19.3,50.04
PORT1.4/GPIO_SPS_5V-OUT_GOOD  (2 unrouted)
  Top 0.254: LV2C:GFE:U2202.PG 27.78,68.24 28.96,67.06 28.96,63.25 30.48,61.72 30.48,57.91
PORT1.8/GPIO_CHARGER_DISABLE_A  (2 unrouted)
PORT1.9/GPIO_CHARGER_DISABLE_B  (2 unrouted)
PORT1.10/GPIO_!BAT_CHARGING!  (3 unrouted)
PORT1.14/GPIO_HAP_3.3V_DISABLE  (2 unrouted)
PORT1.15/GPIO_SPS_5V_PWR_GOOD  (1 unrouted)
PORT1.16/ENET_MDC  (2 unrouted)
PORT1.17/ENET_MDIO  (2 unrouted)
PORT1.18/GPIO_USB_HIGH_SPEED_SELECT  (2 unrouted)
PORT1.19/CAP1.1  (1 unrouted)
PORT1.20/PWM1.2/SCK0  (1 unrouted)
PORT1.21/PWM1.3/SSEL0  (1 unrouted)
PORT1.22/MAT1.0  (1 unrouted)
PORT1.23/PWM1.4/MISO0  (1 unrouted)
PORT1.24/PWM1.5/MOSI0  (1 unrouted)
PORT1.25/MAT1.1  (1 unrouted)
PORT1.26/PWM1.6/CAP0.0  (1 unrouted)
PORT1.27/CAP0.1  (1 unrouted)
PORT1.28/PCAP1.0/MAT0.0  (1 unrouted)
PORT1.29/PCAP1.1/MAT0.1  (1 unrouted)
PORT1.30/VBUS/AD0.4  (1 unrouted)
PORT1.31/GPIO_BAT_CHRG_MONITOR  (3 unrouted)
PORT2.0/PWM1.1/TXD1/TRACECLK  (1 unrouted)
PORT2.1/PWM1.2/RXD1/PIPESTAT0  (1 unrouted)
PORT2.2/PWM1.3/CTS1/PIPESTAT1  (1 unrouted)
PORT2.3/PWM1.4/DCD1/PIPESTAT2  (1 unrouted)
PORT2.4/PWM1.5/DSR1/TRACESYNC  (1 unrouted)
PORT2.5/PWM1.6/DTR1/TRACEPKT0  (1 unrouted)
PORT2.6/PCAP1.0/RI1/TRACEPKT1  (1 unrouted)
PORT2.7/RD2/RTS1/TRACEPKT2  (1 unrouted)
PORT2.8/TD2/TXD2/TRACEPKT3  (1 unrouted)
PORT2.9/USB_CONNECT/RXD2/EXTIN0  (1 unrouted)
PORT2.10/!EINT0!  (4 unrouted)
PORT2.11/!EINT1!/MCIDAT1/I2STX_CLK  (1 unrouted)
PORT2.12/!EINT2!/MCIDAT2/I2STX_WS  (1 unrouted)
PORT2.13/!EINT3!/MCIDAT3/I2STX_SDA  (1 unrouted)
PORT3.25/MAT0.0/PWM1.2  (1 unrouted)
PORT3.26/MAT0.1/RXD3  (1 unrouted)
PORT4.28/MAT2.0/TXD3  (1 unrouted)
PORT4.29/MAT2.1/RXD3  (1 unrouted)
PROTECTED_DC_POWER  (7 unrouted)
  Bottom 0.813: R2212.2 48.68,68.33 R2213.1
REF
  Top 0.61: U2251.4 U2251.5
RTC_XTAL-A  (1 unrouted)
  Top 0.813: C283.2 X282.P$2
RTC_XTAL-B  (1 unrouted)
  Top 0.254: C284.2 5.08,32.13
  Top 0.813: C284.2 X282.P$1
RTCK  (2 unrouted)
SH_GND
  Top 0.406: J2201.B-@1 J2201.B-@2 arc90 8.95,58.17
  Top 1.016: L2203.1 10.41,57.91 9.21,57.91 J2201.B-@2
SLOPECONTROL
  Bottom 0.406: R1.2 9.41,73.99 LV2C:GFE:U2206.8
SOFT_START
  Top 0.254: LV2C:GFE:U2202.RUN/SS 24.26,67.74 24.26,63.75 27.81,63.75 27.81,60.8 C2225.2
  Top 1.016: R2204.1 27.21,60.25 C2225.2
SPS-5V  (via drill 0.2)  (7 unrouted)
  Top 0.254: LV2C:GFE:U2202.BD 23.48,69.74 22.61,70.61 22.61,73.91 23.77,75.08 24.27,75.08 | 13.21,48.77 13.34,48.9 R2254.2
  Top 0.406: 26.54,75.09 R2205.2
  Top 1.27: C2205.1 26.54,75.09
  Top 1.422: CR2250.A 13.21,46.68 13.21,48.77
  Top 1.676: L2201.2 15.01,75.82 23.4,75.82 24.27,75.08 C2205.1
  Route15 0.813: v12.95,48.26 12.95,50.04 12.19,50.8 12.19,73.66 v15.62,75.44 | v13.72,48.26 13.72,50.04 12.95,50.8 12.95,73.41 v16.76,75.44
SPS_3P3_LED  (1 unrouted)
SPS_5_REG  (1 unrouted)
  Bottom 1.016: CR2201.C 51.5,48.53 C2252.2 50.95,45.96 C2252A.2 49.17,42.62
SPS_SYNC  (2 unrouted)
  Top 0.254: LV2C:GFE:U2202.SYNC 27.26,67.74 28.19,66.8 28.19,64.52 28.45,64.26 28.45,62.99 29.97,61.47 29.97,57.91
TCK  (2 unrouted)
TDI  (2 unrouted)
TDO  (2 unrouted)
TMS  (2 unrouted)
USB_D+
  Top 0.254: J2201.USB_H@2 J2201.USB_H@1
  Bottom 0.254: J2201.USB_H@2 6.12,63.27 5.49,62.59 5.49,57.78 5.97,57.28 L281.1
  Bottom 0.61: L281.1 U282.6
USB_D-
  Top 0.254: J2201.USB_L@1 J2201.USB_L@2
  Bottom 0.254: J2201.USB_L@2 9.35,62 9.42,62 10.46,63.04 13.41,63.04 14.22,62.23 14.22,59.69 13.74,59.2 U282.4
  Bottom 0.61: U282.4 L282.1
USBD+
  Bottom 0.406: L281.2 8.48,53.2 R291.1
  Bottom 0.813: R281.1 L281.2
USBD-
  Bottom 0.406: L282.2 R282.1
V+
  Top 0.61: 16.58,45.54 CR2250.C 17.23,46.7 U2251.6
  Top 0.813: CR2250.C 16.83,46.04 15.24,44.45 11.68,44.45 11.18,44.96 11.18,49.44 C2250.2
V_BOOST
  Top 0.254: LV2C:GFE:U2202.BOOST 23.22,69.24 22.1,70.36 22.1,73.92 21.72,74.3 21.54,74.47 C2204.1
V_FEEDBACK  (via drill 0.2)
  Top 0.254: R2206.2 26.86,71.05 27.29,70.62 v27.79,70.62 | LV2C:GFE:U2202.FB 28.62,68.74 v28.9,68.45
  Top 0.406: R2206.2 R2205.1
  Route2 0.254: v28.9,68.45 28.27,69.52 v27.79,70.62
V_SWITCH  (2 unrouted)
  Top 0.254: LV2C:GFE:U2202.SW 22.1,68.74 D2201.CATHODE
  Top 1.016: D2201.CATHODE 19.47,71.37
  pour Top (isolate 0.254): 20.4,73.56 20.24,74.07 20.22,75.21 18.11,75.23 17.98,75.23 16.54,74.78 8.81,74.68 8.81,73.81 8.94,70.36 8.92,69.06 21.46,69.32 21.49,69.8 21.49,72.87 21.46,73.53
VIN
  Top 0.254: LV2C:GFE:U2202.VIN 23.53,68.24 23.37,68.07 23.37,65.18 C2202.1 22.32,64.13 R2252.2 | R2253.2 21.88,62.59 R2252.2 | R2252.2 22.54,62.37 24.38,62.37 | 24.38,62.37 C2201.1 | R2204.2 24.38,60.52 24.38,62.37
  pour Top (isolate 0.254, no thermals): 23.85,59.79 23.85,61.57 21.08,61.59 21.08,62.1 19.41,62.08 19.41,63.22 21.26,63.22 21.36,65.46 23.7,65.46 23.65,63.09 24.87,63.09 24.89,61.21 24.87,59.79
VINA  (4 unrouted)
  Bottom 0.813: R3.1 55.22,64.69 R4.2
VS
  Top 0.254: 25.72,49.38 C2207.2 26,50.86 TVS2201.C 24.79,54.56 U2250.1 22.08,54.94 Q2250.4 | 25.72,49.38 C2206.+ 22.25,50.1 R2250.2 | 25.72,49.38 27.37,47.72 LV2C:GFE:F2201.2
  pour Top (isolate 0.254): 22.38,45.85 22.35,53.09 21.34,53.59 21.31,56.44 22.73,56.39 24.26,55.5 27.64,55.55 28.45,54.36 28.45,52.83 27.18,51.82 27.18,49.28 29.16,48.26 29.18,45.31 22.94,45.31
VS_SENSE
  Top 0.254: Q2250.2 Q2250.1 Q2250.6 | Q2250.6 Q2250.5 | Q2250.6 22.08,60.01 R2252.1
  pour Top (isolate 0.254, no thermals): 19.08,57.28 19.05,59.79 20.88,59.79 21.41,60.68 22.96,60.76 23.01,59.54 22.53,59.03 22.53,57.28